# Altium schematic sheet MCP3423.schdoc: TITRE
size Letter; ApprovedBy: APPROUVÉ PAR; Organization: Cegep Limoilou; Address1: 1300, 8e Avenue; Address2: Québec, QC; Address3: Canada; Address4: G1J 5L5; SheetNumber: 3; SheetTotal: 6
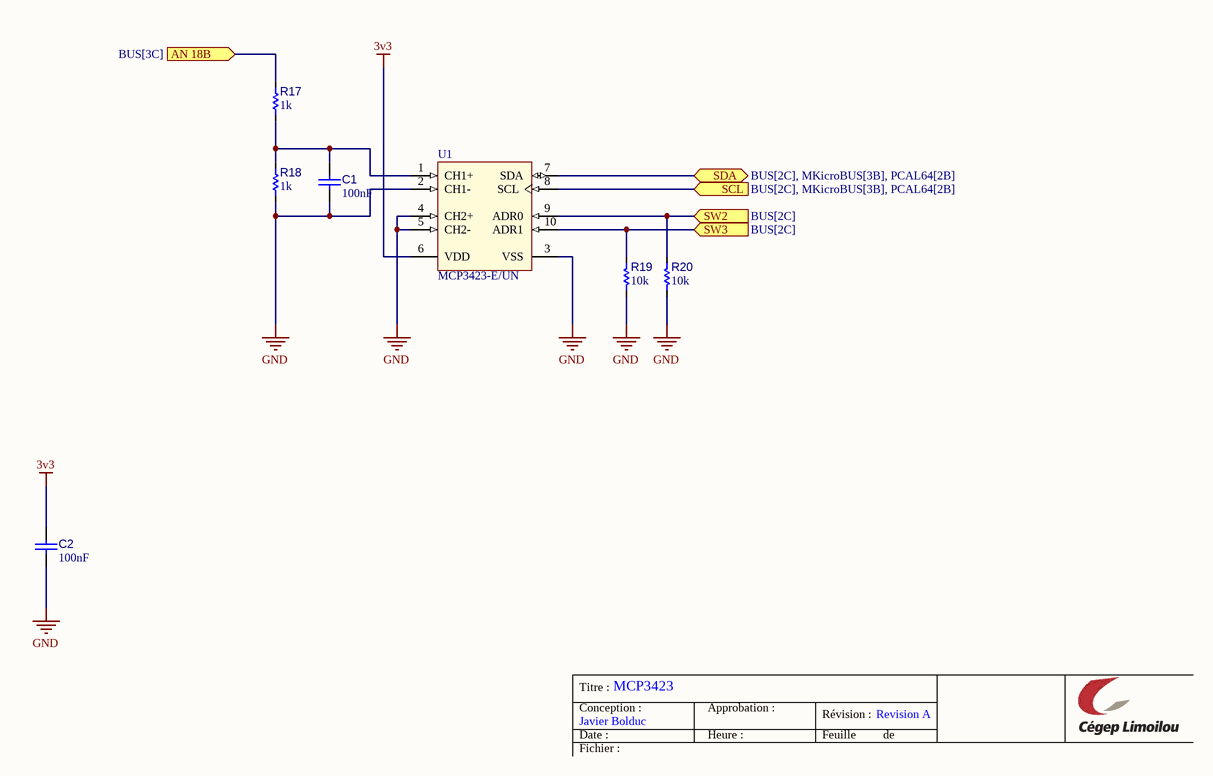
[diagram p0: MCP3423.schdoc]

## Parts
C1  value 100nF  [C_1608[0603]]  (hidden comment: CAP CER 100nF 50V 0603)
C2  value 100nF  [C_1608[0603]]  (hidden comment: CAP CER 100nF 50V 0603)
R17  value 1k  [R_1608[0603]]  (hidden comment: Res 1k 1% 0603)
R18  value 1k  [R_1608[0603]]  (hidden comment: Res 1k 1% 0603)
R19  value 10k  [R_1608[0603]]  (hidden comment: Res 10k 1% 0603)
R20  value 10k  [R_1608[0603]]  (hidden comment: Res 10k 1% 0603)
U1  MCP3423-E/UN  [U_MSOP50P300X500-10(RM-10)_WO-TP]

## Ports
AN 18B (in, see BUS[3C]), SCL (in, see BUS[2C], MKicroBUS[3B], PCAL64[2B]), SDA (bidir, see BUS[2C], MKicroBUS[3B], PCAL64[2B]), SW2 (in, see BUS[2C]), SW3 (in, see BUS[2C])

## Nets
3v3: C2.2 U1.6(VDD)
GND: C1.2 C2.1 R18.2 R19.2 R20.2 U1.2(CH1-) U1.3(VSS) U1.4(CH2+) U1.5(CH2-)
AN 18B: R17.1 ; port AN 18B
SCL: U1.8(SCL) ; port SCL
SDA: U1.7(SDA) ; port SDA
SW2: R20.1 U1.9(ADR0) ; port SW2
SW3: R19.1 U1.10(ADR1) ; port SW3
NetC1_1: C1.1 R17.2 R18.1 U1.1(CH1+)

## Notes on the sheet
- Titre :
- Conception :
- Date :
- Javier Bolduc
- MCP3423
- Approbation :
- Heure :
- Révision :
- Feuille
- Revision A
- de
- Fichier :

## Library data of the parts
C1 C2 = CAP002: Capacitor type 1; Manufacturer 1: Yageo; Manufacturer Part Number 1: CC0603KRX7R9BB104; LibRef: CAP002; Code CEGEP: COND0143SM; Tolerance: 10%; Dielectric: X7R; Rated Voltage: 50V; Mounting Technology: SMT; Supplier 1: LCSC; Supplier Part Number 1: C14663
R17 R18 = RES015: Resistor type 1; Manufacturer 1: Yageo; Manufacturer Part Number 1: RC0603FR-071KL; LibRef: RES015; Puissance: 1/10W; Max Working Voltage: 75V; Tolerance: 1%; Mounting Technology: SMT; Supplier 1: LCSC; Supplier Part Number 1: C22548
R19 R20 = RES001: Resistor type 1; Manufacturer 1: Yageo; Manufacturer Part Number 1: RC0603FR-0710KL; LibRef: RES001; Puissance: 1/10W; Max Working Voltage: 75V; Code CEGEP: RESI0238-0603; Tolerance: 1%; Mounting Technology: SMT; Supplier 1: LCSC; Supplier Part Number 1: C98220
U1 = U_MCP3423-E/UN: CAN Controller Stand-Alone With SPI, 18-Pin PDIP; Manufacturer 1: Microchip; Manufacturer Part Number 1: MCP3423-E/UN; Supplier 1: LCSC; Supplier Part Number 1: C220864; Mounting Technology: SMT; Supplier 2: Digikey; Supplier Part Number 2: MCP3423-E/UN-ND